# EasyEDA schematic SCH_ELLIE_DISPLAY_PANEL_2023-12-06.json
TITLE: ELLIE Display Panel; REV: 1.0; Date: 2023-11-07; Sheet: 1/1; Drawn By: wouterpennings; Company: Fontys ICT
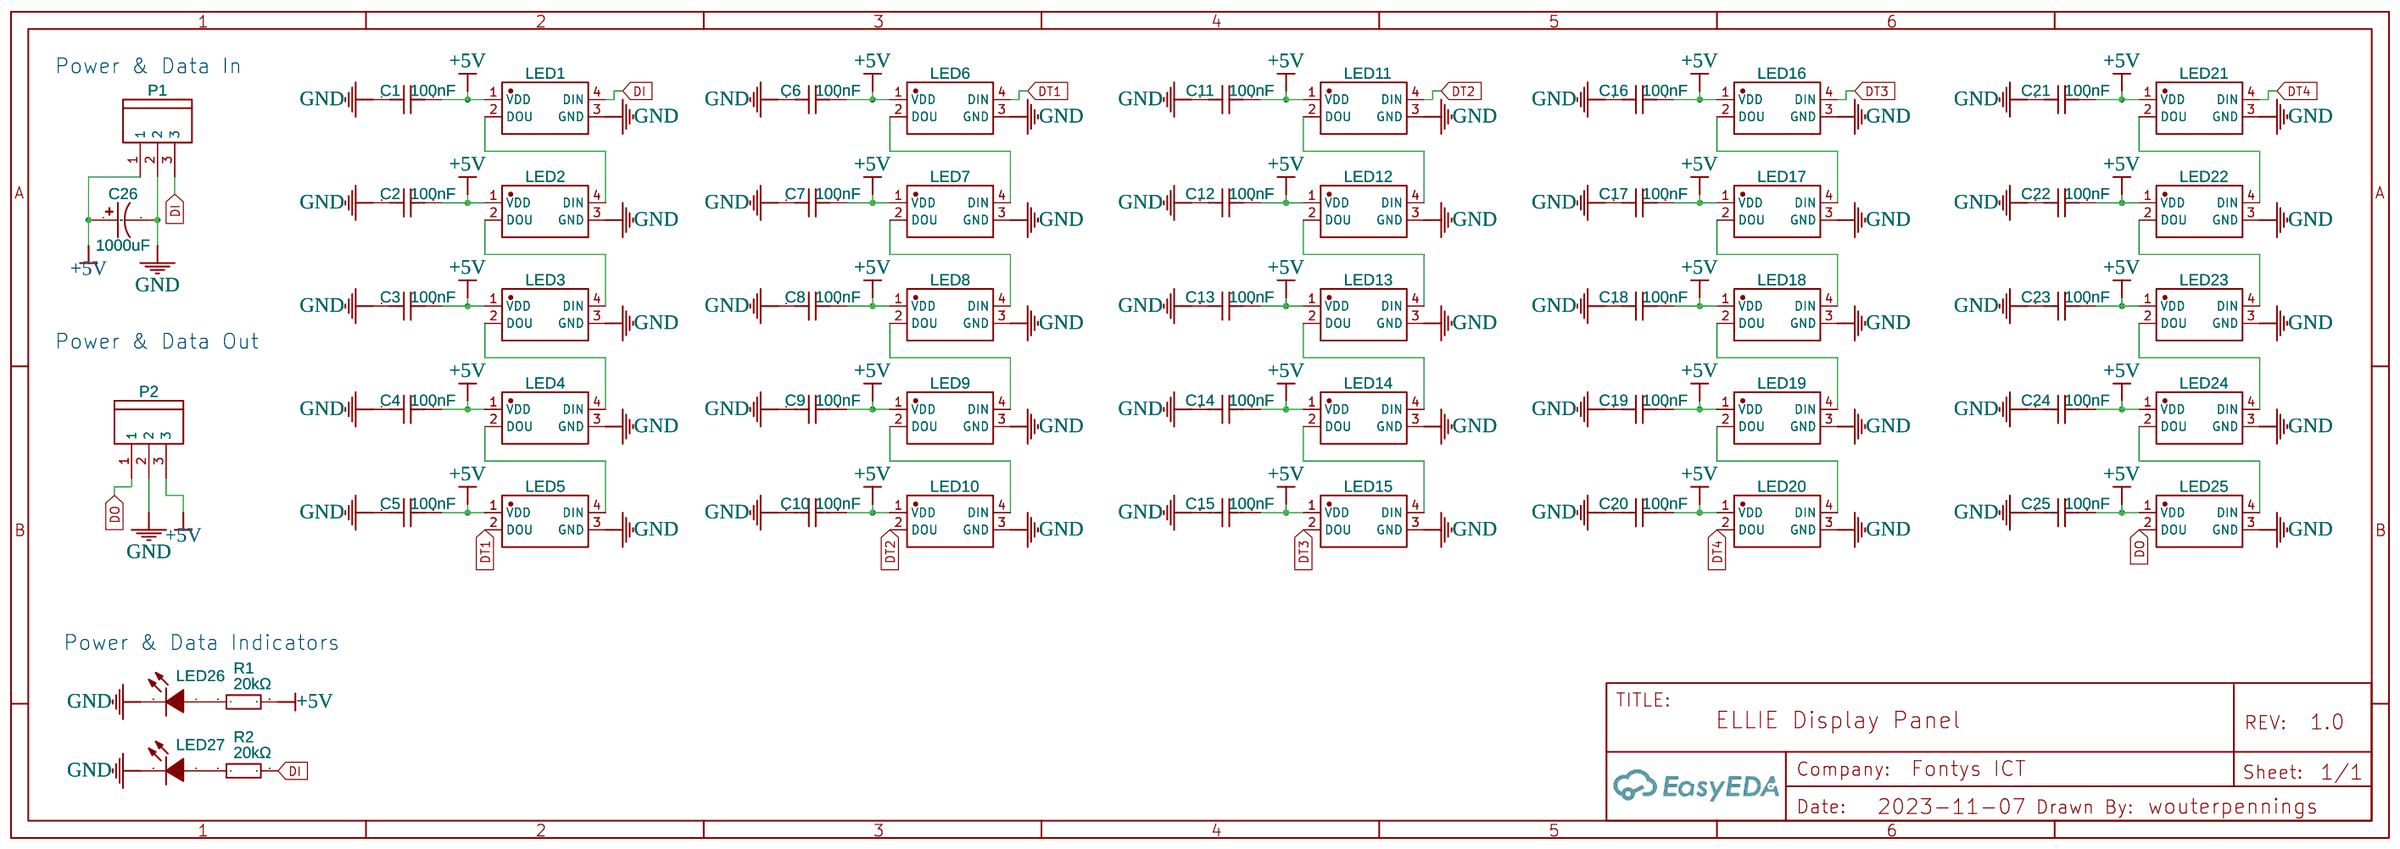
[diagram p0: schematic sheet]

## Parts
C1  100nF  [C0402]
C2  100nF  [C0402]
C3  100nF  [C0402]
C4  100nF  [C0402]
C5  100nF  [C0402]
C6  100nF  [C0402]
C7  100nF  [C0402]
C8  100nF  [C0402]
C9  100nF  [C0402]
C10  100nF  [C0402]
C11  100nF  [C0402]
C12  100nF  [C0402]
C13  100nF  [C0402]
C14  100nF  [C0402]
C15  100nF  [C0402]
C16  100nF  [C0402]
C17  100nF  [C0402]
C18  100nF  [C0402]
C19  100nF  [C0402]
C20  100nF  [C0402]
C21  100nF  [C0402]
C22  100nF  [C0402]
C23  100nF  [C0402]
C24  100nF  [C0402]
C25  100nF  [C0402]
C26  1000uF  [CAP-TH_BD10.0-P5.00-D1.0-FD]
LED1  XL-5050RGBC-WS2812B  [LED-SMD_4P-L5.0-W5.0-BL_XL-5050RGBC]
LED2  XL-5050RGBC-WS2812B  [LED-SMD_4P-L5.0-W5.0-BL_XL-5050RGBC]
LED3  XL-5050RGBC-WS2812B  [LED-SMD_4P-L5.0-W5.0-BL_XL-5050RGBC]
LED4  XL-5050RGBC-WS2812B  [LED-SMD_4P-L5.0-W5.0-BL_XL-5050RGBC]
LED5  XL-5050RGBC-WS2812B  [LED-SMD_4P-L5.0-W5.0-BL_XL-5050RGBC]
LED6  XL-5050RGBC-WS2812B  [LED-SMD_4P-L5.0-W5.0-BL_XL-5050RGBC]
LED7  XL-5050RGBC-WS2812B  [LED-SMD_4P-L5.0-W5.0-BL_XL-5050RGBC]
LED8  XL-5050RGBC-WS2812B  [LED-SMD_4P-L5.0-W5.0-BL_XL-5050RGBC]
LED9  XL-5050RGBC-WS2812B  [LED-SMD_4P-L5.0-W5.0-BL_XL-5050RGBC]
LED10  XL-5050RGBC-WS2812B  [LED-SMD_4P-L5.0-W5.0-BL_XL-5050RGBC]
LED11  XL-5050RGBC-WS2812B  [LED-SMD_4P-L5.0-W5.0-BL_XL-5050RGBC]
LED12  XL-5050RGBC-WS2812B  [LED-SMD_4P-L5.0-W5.0-BL_XL-5050RGBC]
LED13  XL-5050RGBC-WS2812B  [LED-SMD_4P-L5.0-W5.0-BL_XL-5050RGBC]
LED14  XL-5050RGBC-WS2812B  [LED-SMD_4P-L5.0-W5.0-BL_XL-5050RGBC]
LED15  XL-5050RGBC-WS2812B  [LED-SMD_4P-L5.0-W5.0-BL_XL-5050RGBC]
LED16  XL-5050RGBC-WS2812B  [LED-SMD_4P-L5.0-W5.0-BL_XL-5050RGBC]
LED17  XL-5050RGBC-WS2812B  [LED-SMD_4P-L5.0-W5.0-BL_XL-5050RGBC]
LED18  XL-5050RGBC-WS2812B  [LED-SMD_4P-L5.0-W5.0-BL_XL-5050RGBC]
LED19  XL-5050RGBC-WS2812B  [LED-SMD_4P-L5.0-W5.0-BL_XL-5050RGBC]
LED20  XL-5050RGBC-WS2812B  [LED-SMD_4P-L5.0-W5.0-BL_XL-5050RGBC]
LED21  XL-5050RGBC-WS2812B  [LED-SMD_4P-L5.0-W5.0-BL_XL-5050RGBC]
LED22  XL-5050RGBC-WS2812B  [LED-SMD_4P-L5.0-W5.0-BL_XL-5050RGBC]
LED23  XL-5050RGBC-WS2812B  [LED-SMD_4P-L5.0-W5.0-BL_XL-5050RGBC]
LED24  XL-5050RGBC-WS2812B  [LED-SMD_4P-L5.0-W5.0-BL_XL-5050RGBC]
LED25  XL-5050RGBC-WS2812B  [LED-SMD_4P-L5.0-W5.0-BL_XL-5050RGBC]
LED26  SZYY0805R  [LED0805-R-RD]
LED27  SZYY0805R  [LED0805-R-RD]
P1  WJ500V-5.08-3P-14-00A  [CONN-TH_3P-P5.00_WJ500V-5.08-3P]
P2  WJ500V-5.08-3P-14-00A  [CONN-TH_3P-P5.00_WJ500V-5.08-3P]
R1  20kΩ  [R0603]
R2  20kΩ  [R0603]

## Library data of the parts
C1-C25 = CC0402KRX7R7BB104: Supplier: LCSC; Manufacturer: YAGEO(国巨); Supplier Part: C60474; JLCPCB Part Class: Extended Part; link: https://lcsc.com/eda_search?q=C60474&%26type=1&ref=editor
C26 = 01EC4294SHC1000UF25V: Contributor: LCSC; Supplier: LCSC; Supplier Part: C503217; Manufacturer: KNSCHA(科尼盛); JLCPCB Part Class: Extended Part; link: https://lcsc.com/eda_search?q=C503217&%26type=1&ref=editor
LED1-LED25 = XL-5050RGBC-WS2812B: Contributor: LCSC; Supplier: LCSC; Supplier Part: C2843785; Manufacturer: XINGLIGHT(成兴光); JLCPCB Part Class: Extended Part; link: https://lcsc.com/eda_search?q=C2843785&%26type=1&ref=editor
LED26 LED27 = SZYY0805R: Contributor: LCSC; JLCPCB Part Class: Extended Part; Supplier: LCSC; Supplier Part: C434431; Manufacturer: yongyu(永裕光电); link: https://lcsc.com/eda_search?q=C434431&%26type=1&ref=editor
P1 P2 = WJ500V-5.08-3P-14-00A: Supplier: LCSC; Manufacturer: KANGNEX(康奈克斯电气); Manufacturer Part: WJ500V-5.08-3P; Supplier Part: C72334; JLCPCB Part Class: Extended Part; link: https://lcsc.com/eda_search?q=C72334&%26type=1&ref=editor
R1 R2 = 0603WAF2002T5E: Supplier: LCSC; Manufacturer: UNI-ROYAL(厚声); Supplier Part: C4184; JLCPCB Part Class: Basic Part; link: https://lcsc.com/eda_search?q=C4184&%26type=1&ref=editor

## Nets
+5V: C1.2 C2.2 C3.2 C4.2 C5.2 C6.2 C7.2 C8.2 C9.2 C10.2 C11.2 C12.2 C13.2 C14.2 C15.2 C16.2 C17.2 C18.2 C19.2 C20.2 C21.2 C22.2 C23.2 C24.2 C25.2 C26.1 LED1.1(VDD) LED2.1(VDD) LED3.1(VDD) LED4.1(VDD) LED5.1(VDD) LED6.1(VDD) LED7.1(VDD) LED8.1(VDD) LED9.1(VDD) LED10.1(VDD) LED11.1(VDD) LED12.1(VDD) LED13.1(VDD) LED14.1(VDD) LED15.1(VDD) LED16.1(VDD) LED17.1(VDD) LED18.1(VDD) LED19.1(VDD) LED20.1(VDD) LED21.1(VDD) LED22.1(VDD) LED23.1(VDD) LED24.1(VDD) LED25.1(VDD) P1.1 P2.3 R1.2
GND: C1.1 C2.1 C3.1 C4.1 C5.1 C6.1 C7.1 C8.1 C9.1 C10.1 C11.1 C12.1 C13.1 C14.1 C15.1 C16.1 C17.1 C18.1 C19.1 C20.1 C21.1 C22.1 C23.1 C24.1 C25.1 C26.2 LED1.3(GND) LED2.3(GND) LED3.3(GND) LED4.3(GND) LED5.3(GND) LED6.3(GND) LED7.3(GND) LED8.3(GND) LED9.3(GND) LED10.3(GND) LED11.3(GND) LED12.3(GND) LED13.3(GND) LED14.3(GND) LED15.3(GND) LED16.3(GND) LED17.3(GND) LED18.3(GND) LED19.3(GND) LED20.3(GND) LED21.3(GND) LED22.3(GND) LED23.3(GND) LED24.3(GND) LED25.3(GND) LED26.2(-) LED27.2(-) P1.2 P2.2
DI: LED1.4(DIN) P1.3 R2.2
DO: LED25.2(DOU) P2.1
DT1: LED5.2(DOU) LED6.4(DIN)
DT2: LED10.2(DOU) LED11.4(DIN)
DT3: LED15.2(DOU) LED16.4(DIN)
DT4: LED20.2(DOU) LED21.4(DIN)
Net-(LED1-2): LED1.2(DOU) LED2.4(DIN)
Net-(LED2-2): LED2.2(DOU) LED3.4(DIN)
Net-(LED3-2): LED3.2(DOU) LED4.4(DIN)
Net-(LED4-2): LED4.2(DOU) LED5.4(DIN)
Net-(LED6-2): LED6.2(DOU) LED7.4(DIN)
Net-(LED7-2): LED7.2(DOU) LED8.4(DIN)
Net-(LED8-2): LED8.2(DOU) LED9.4(DIN)
Net-(LED9-2): LED9.2(DOU) LED10.4(DIN)
Net-(LED11-2): LED11.2(DOU) LED12.4(DIN)
Net-(LED12-2): LED12.2(DOU) LED13.4(DIN)
Net-(LED13-2): LED13.2(DOU) LED14.4(DIN)
Net-(LED14-2): LED14.2(DOU) LED15.4(DIN)
Net-(LED16-2): LED16.2(DOU) LED17.4(DIN)
Net-(LED17-2): LED17.2(DOU) LED18.4(DIN)
Net-(LED18-2): LED18.2(DOU) LED19.4(DIN)
Net-(LED19-2): LED19.2(DOU) LED20.4(DIN)
Net-(LED21-2): LED21.2(DOU) LED22.4(DIN)
Net-(LED22-2): LED22.2(DOU) LED23.4(DIN)
Net-(LED23-2): LED23.2(DOU) LED24.4(DIN)
Net-(LED24-2): LED24.2(DOU) LED25.4(DIN)
Net-(LED26-1): LED26.1(+) R1.1
Net-(LED27-1): LED27.1(+) R2.1

## Notes on the sheet
- Power & Data In
- Power & Data Out
- Power & Data Indicators
